# Altium schematic sheet Grabber.schdoc: Grabber
size 420 x 297 mm; Author: G.K.; CompanyName: WUT; DrawnBy: G.K.; Organization: WUT; Address1: Warsaw Univeristy of Technology; Address2: Nowowiejska 15/19; DocumentNumber: 1; SheetNumber: 1; SheetTotal: 2; EDA_Number: ARTIQ; Projet: KASLI 3U subsystem; ModifiedBy: -; CreateDate: XX/XX/XXXX; CheckedDate: -; Title2: Extension board; DivGrp: ISE; Designer: G.K.; ModifiedDate: -; ProjectName: KASLI 3U subsystem
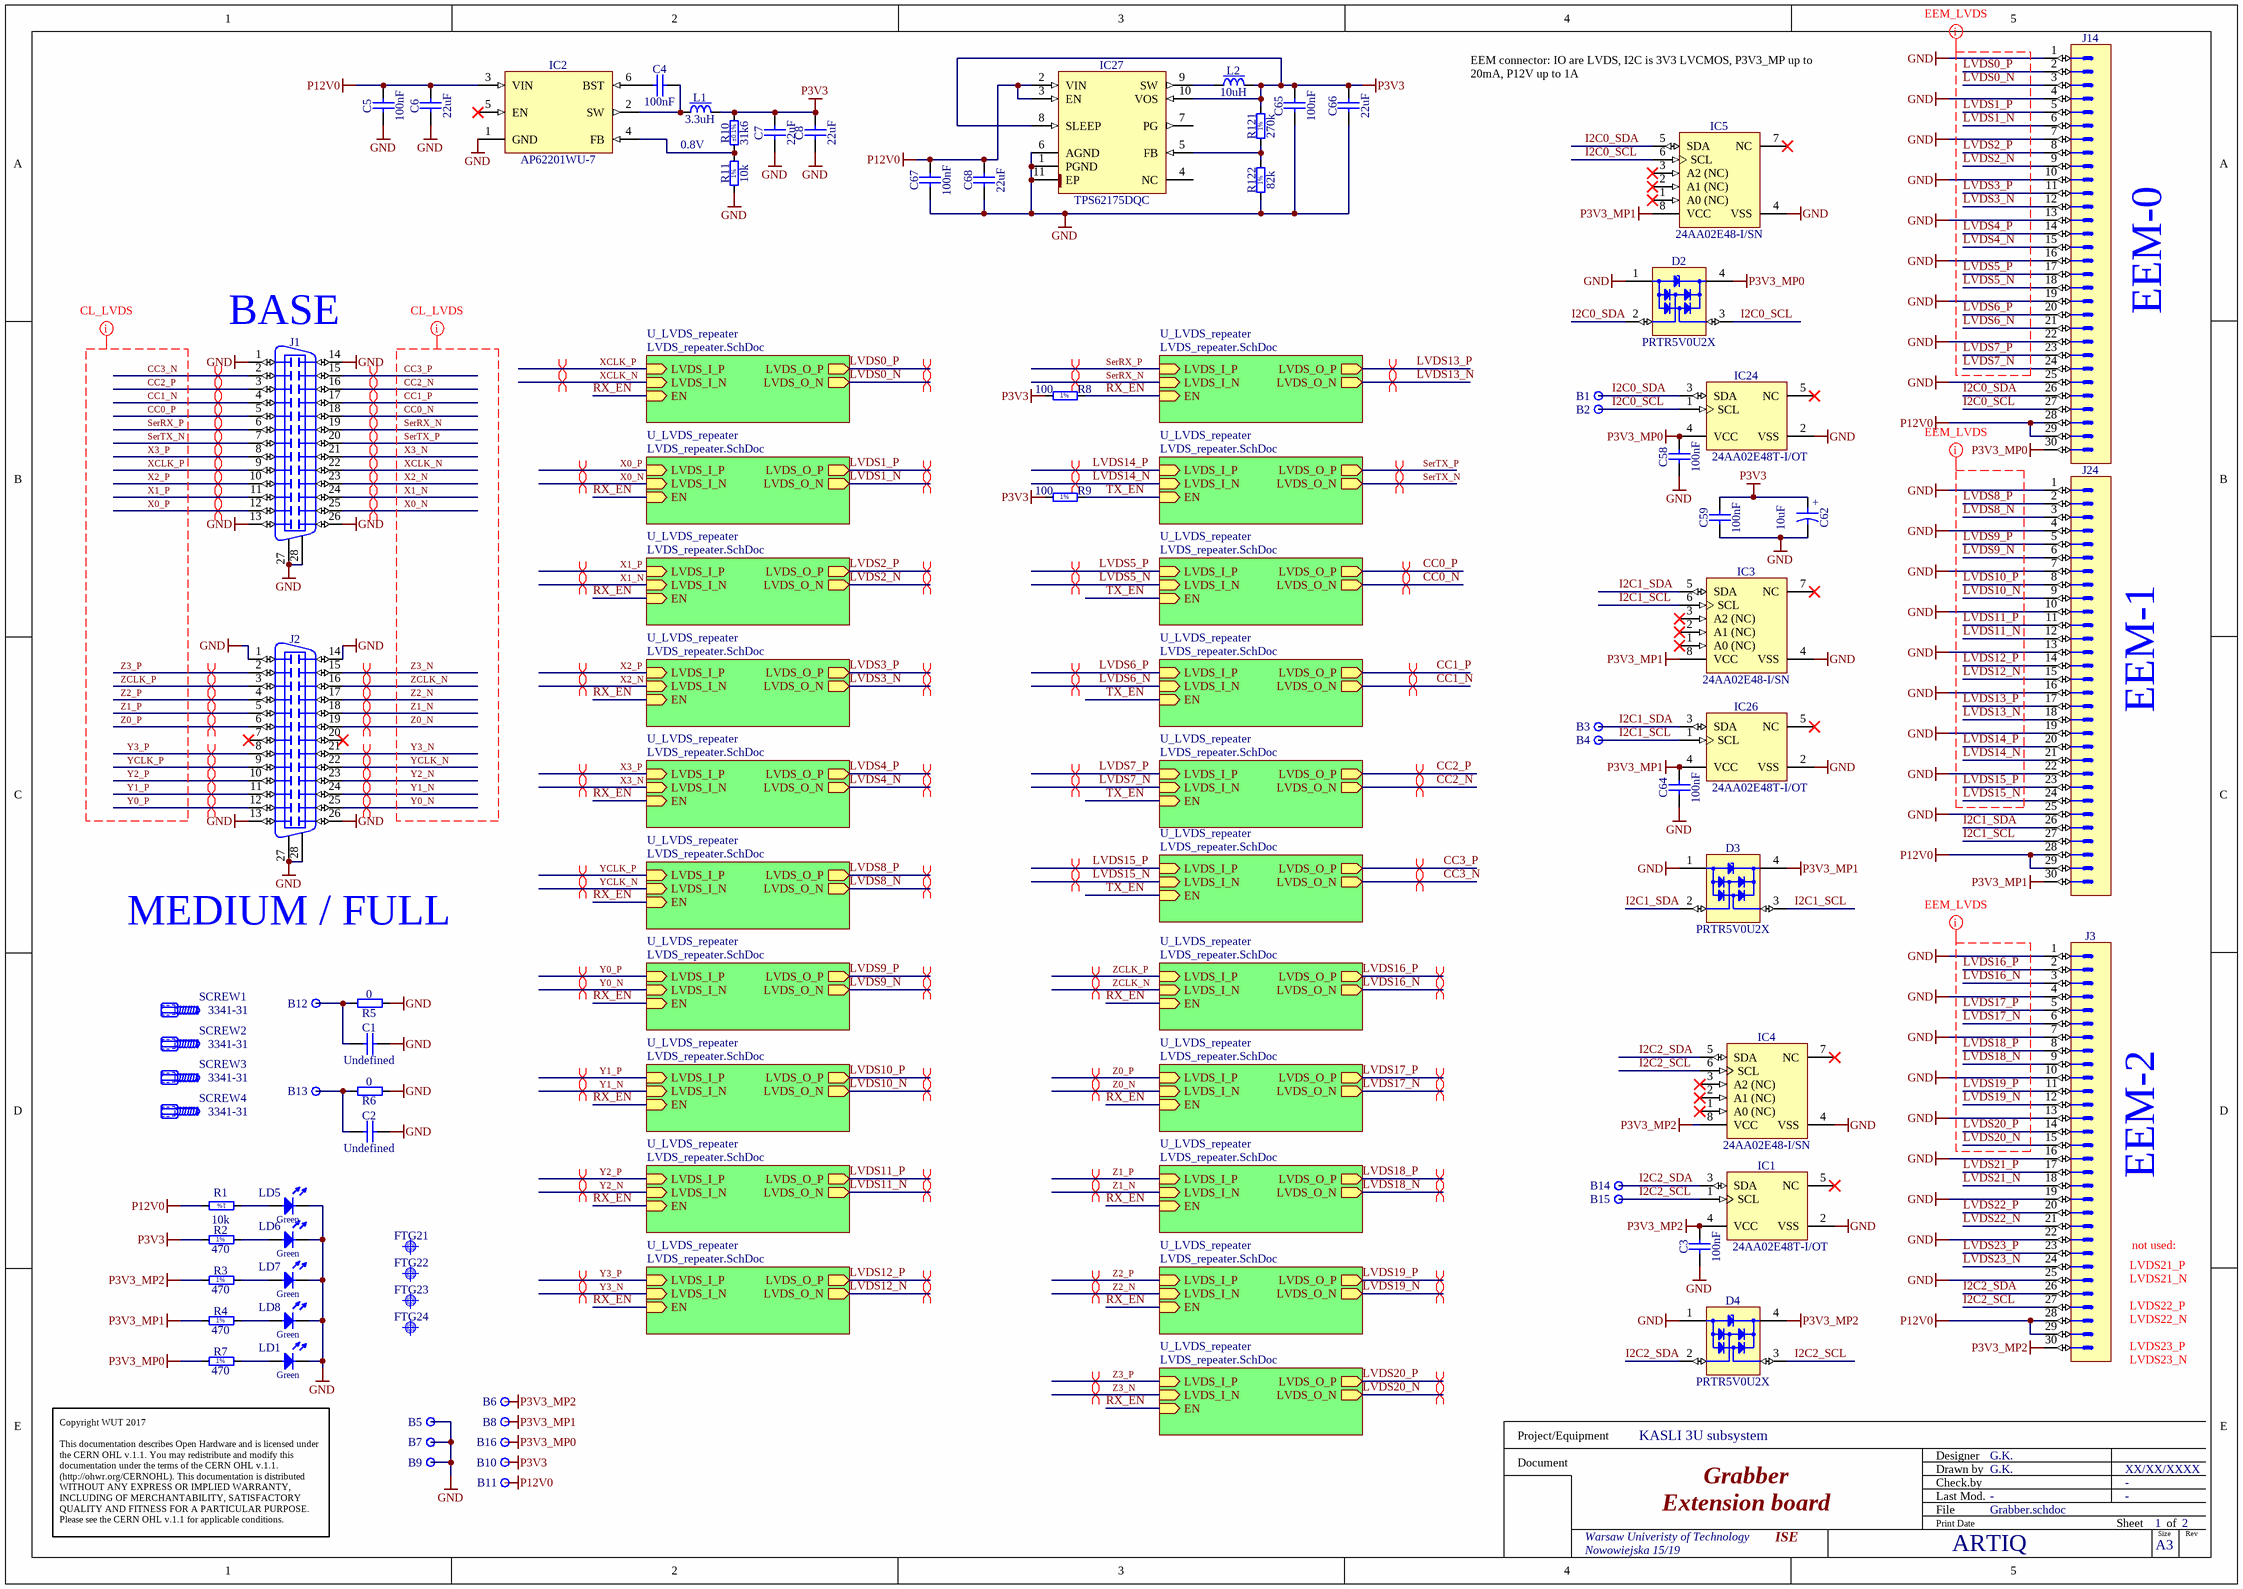
[diagram p0: Grabber.schdoc]

## Parts
B1  Plated Hole  [c130h60]  (value not drawn)
B2  Plated Hole  [c130h60]  (value not drawn)
B3  Plated Hole  [c130h60]  (value not drawn)
B4  Plated Hole  [c130h60]  (value not drawn)
B5  Plated Hole  [c130h60]  (value not drawn)
B6  Plated Hole  [c130h60]  (value not drawn)
B7  Plated Hole  [c130h60]  (value not drawn)
B8  Plated Hole  [c130h60]  (value not drawn)
B9  Plated Hole  [c130h60]  (value not drawn)
B10  Plated Hole  [c130h60]  (value not drawn)
B11  Plated Hole  [c130h60]  (value not drawn)
B12  Plated Hole  [MTG270_500]  (value not drawn)
B13  Plated Hole  [MTG270_500]  (value not drawn)
B14  Plated Hole  [c130h60]  (value not drawn)
B15  Plated Hole  [c130h60]  (value not drawn)
B16  Plated Hole  [c130h60]  (value not drawn)
C1  Undefined  [CAPC2012X135N]
C2  Undefined  [CAPC2012X135N]
C3  100nF  [CAPC1005X55N]
C4  100nF  [CAPC1005X55N]
C5  100nF  [CAPC1005X55N]
C6  22uF  [CAPC2012X135N]
C7  22uF  [CAPC2012X135N]
C8  22uF  [CAPC2012X135N]
C58  100nF  [CAPC1005X55N]
C59  100nF  [CAPC1005X55N]
C62  10uF  [CAPAE430X540N]
C64  100nF  [CAPC1005X55N]
C65  100nF  [CAPC1005X55N]
C66  22uF  [CAPC2012X135N]
C67  100nF  [CAPC1005X55N]
C68  22uF  [CAPC2012X135N]
D2  PRTR5V0U2X  [SOT190P230X110-4N]
D3  PRTR5V0U2X  [SOT190P230X110-4N]
D4  PRTR5V0U2X  [SOT190P230X110-4N]
FTG21  Use only in PCB  [FIDUCIAL_TOP_C100-200]  (value not drawn)
FTG22  Use only in PCB  [FIDUCIAL_TOP_S100-200]  (value not drawn)
FTG23  Use only in PCB  [FIDUCIAL_TOP_S200-400]  (value not drawn)
FTG24  Use only in PCB  [FIDUCIAL_TOP_S100-200]  (value not drawn)
IC1  24AA02E48T-I/OT  [SOT95P280X145-5N]
IC2  AP62201WU-7  [SOT95P280X100-6N]
IC3  24AA02E48-I/SN  [SOIC127P600X175-8N]
IC4  24AA02E48-I/SN  [SOIC127P600X175-8N]
IC5  24AA02E48-I/SN  [SOIC127P600X175-8N]
IC24  24AA02E48T-I/OT  [SOT95P280X145-5N]
IC26  24AA02E48T-I/OT  [SOT95P280X145-5N]
IC27  TPS62175DQC  [SON50P200X300X80-11N-R94X250]
J1  MDR 26  [3M_N10226-5212PC]  (value not drawn)
J2  MDR 26  [3M_N10226-5212PC]  (value not drawn)
J3  (no value)  [3M_N2530-6002RB]
J14  (no value)  [3M_N2530-6002RB]
J24  (no value)  [3M_N2530-6002RB]
L1  3.3uH  [IND_WURTH_WE-TPC_4828]
L2  10uH  [IND_MURATA-PS_8400]
LD1  Green  [LED_KINGBRIGHT_KPH-1608CGCK]  (value not drawn)
LD5  Green  [LED_KINGBRIGHT_KPH-1608CGCK]  (value not drawn)
LD6  Green  [LED_KINGBRIGHT_KPH-1608CGCK]  (value not drawn)
LD7  Green  [LED_KINGBRIGHT_KPH-1608CGCK]  (value not drawn)
LD8  Green  [LED_KINGBRIGHT_KPH-1608CGCK]  (value not drawn)
R1  10k  [RESC1005X40N]
R2  470  [RESC1005X40N]
R3  470  [RESC1005X40N]
R4  470  [RESC1005X40N]
R5  0  [RESC1608X55N]
R6  0  [RESC1608X55N]
R7  470  [RESC1005X40N]
R8  100  [RESC1005X40N]
R9  100  [RESC1005X40N]
R10  31k6  Tolerance: ±0.1%  [RESC1005X35N]
R11  10k  [RESC1005X40N]
R121  270k  [RESC1608X55N]
R122  82k  [RESC1608X55N]
SCREW1  3341-31  [3M_3341-31]
SCREW2  3341-31  [3M_3341-31]
SCREW3  3341-31  [3M_3341-31]
SCREW4  3341-31  [3M_3341-31]

## Sub-sheets
U_LVDS_repeater = LVDS_repeater.SchDoc: LVDS_I_P (in), LVDS_I_N (in), LVDS_O_P (out), LVDS_O_N (out), EN (in)
U_LVDS_repeater = LVDS_repeater.SchDoc: LVDS_I_P (in), LVDS_I_N (in), LVDS_O_P (out), LVDS_O_N (out), EN (in)
U_LVDS_repeater = LVDS_repeater.SchDoc: LVDS_I_P (in), LVDS_I_N (in), LVDS_O_P (out), LVDS_O_N (out), EN (in)
U_LVDS_repeater = LVDS_repeater.SchDoc: LVDS_I_P (in), LVDS_I_N (in), LVDS_O_P (out), LVDS_O_N (out), EN (in)
U_LVDS_repeater = LVDS_repeater.SchDoc: LVDS_I_P (in), LVDS_I_N (in), LVDS_O_P (out), LVDS_O_N (out), EN (in)
U_LVDS_repeater = LVDS_repeater.SchDoc: LVDS_I_P (in), LVDS_I_N (in), LVDS_O_P (out), LVDS_O_N (out), EN (in)
U_LVDS_repeater = LVDS_repeater.SchDoc: LVDS_I_P (in), LVDS_I_N (in), LVDS_O_P (out), LVDS_O_N (out), EN (in)
U_LVDS_repeater = LVDS_repeater.SchDoc: LVDS_I_P (in), LVDS_I_N (in), LVDS_O_P (out), LVDS_O_N (out), EN (in)
U_LVDS_repeater = LVDS_repeater.SchDoc: LVDS_I_P (in), LVDS_I_N (in), LVDS_O_P (out), LVDS_O_N (out), EN (in)
U_LVDS_repeater = LVDS_repeater.SchDoc: LVDS_I_P (in), LVDS_I_N (in), LVDS_O_P (out), LVDS_O_N (out), EN (in)
U_LVDS_repeater = LVDS_repeater.SchDoc: LVDS_I_P (in), LVDS_I_N (in), LVDS_O_P (out), LVDS_O_N (out), EN (in)
U_LVDS_repeater = LVDS_repeater.SchDoc: LVDS_I_P (in), LVDS_I_N (in), LVDS_O_P (out), LVDS_O_N (out), EN (in)
U_LVDS_repeater = LVDS_repeater.SchDoc: LVDS_I_P (in), LVDS_I_N (in), LVDS_O_P (out), LVDS_O_N (out), EN (in)
U_LVDS_repeater = LVDS_repeater.SchDoc: LVDS_I_P (in), LVDS_I_N (in), LVDS_O_P (out), LVDS_O_N (out), EN (in)
U_LVDS_repeater = LVDS_repeater.SchDoc: LVDS_I_P (in), LVDS_I_N (in), LVDS_O_P (out), LVDS_O_N (out), EN (in)
U_LVDS_repeater = LVDS_repeater.SchDoc: LVDS_I_P (in), LVDS_I_N (in), LVDS_O_P (out), LVDS_O_N (out), EN (in)
U_LVDS_repeater = LVDS_repeater.SchDoc: LVDS_I_P (in), LVDS_I_N (in), LVDS_O_P (out), LVDS_O_N (out), EN (in)
U_LVDS_repeater = LVDS_repeater.SchDoc: LVDS_I_P (in), LVDS_I_N (in), LVDS_O_P (out), LVDS_O_N (out), EN (in)
U_LVDS_repeater = LVDS_repeater.SchDoc: LVDS_I_P (in), LVDS_I_N (in), LVDS_O_P (out), LVDS_O_N (out), EN (in)
U_LVDS_repeater = LVDS_repeater.SchDoc: LVDS_I_P (in), LVDS_I_N (in), LVDS_O_P (out), LVDS_O_N (out), EN (in)
U_LVDS_repeater = LVDS_repeater.SchDoc: LVDS_I_P (in), LVDS_I_N (in), LVDS_O_P (out), LVDS_O_N (out), EN (in)

## Nets
GND: B5.1 B7.1 B9.1 C1.2 C2.2 C3.1 C5.1 C6.1 C7.1 C8.1 C58.1 C59.1 C62.2 C64.1 C65.1 C66.1 C67.1 C68.1 D2.1(GND) D3.1(GND) D4.1(GND) IC1.2(VSS) IC2.1(GND) IC3.4(VSS) IC4.4(VSS) IC5.4(VSS) IC24.2(VSS) IC26.2(VSS) IC27.1(PGND) IC27.6(AGND) IC27.11(EP) J1.1 J1.13 J1.14 J1.26 J1.27 J1.28 J2.1 J2.13 J2.14 J2.26 J2.27 J2.28 J3.1 J3.4 J3.7 J3.10 J3.13 J3.16 J3.19 J3.22 J3.25 J14.1 J14.4 J14.7 J14.10 J14.13 J14.16 J14.19 J14.22 J14.25 J24.1 J24.4 J24.7 J24.10 J24.13 J24.16 J24.19 J24.22 J24.25 LD1.1(C) LD5.1(C) LD6.1(C) LD7.1(C) LD8.1(C) R5.1 R6.1 R11.1 R122.1
P3V3: B10.1 C7.2 C8.2 C59.2 C62.1 C65.2 C66.2 IC27.8(SLEEP) IC27.10(VOS) L1.2 L2.2 R2.1 R8.1 R9.1 R10.2 R121.2
P3V3_MP0: B16.1 C58.2 D2.4(VCC) IC24.4(VCC) J14.30 R7.1
P3V3_MP1: B8.1 C64.2 D3.4(VCC) IC3.8(VCC) IC5.8(VCC) IC26.4(VCC) J24.30 R4.1
P3V3_MP2: B6.1 C3.2 D4.4(VCC) IC1.4(VCC) IC4.8(VCC) J3.30 R3.1
P12V0: B11.1 C5.2 C6.2 C67.2 C68.2 IC2.3(VIN) IC27.2(VIN) IC27.3(EN) J3.28 J3.29 J14.28 J14.29 J24.28 J24.29 R1.2
CC0_N: J1.18 ; sheet U_LVDS_repeater/LVDS_O_N
CC0_P: J1.5 ; sheet U_LVDS_repeater/LVDS_O_P
CC1_N: J1.4 ; sheet U_LVDS_repeater/LVDS_O_N
CC1_P: J1.17 ; sheet U_LVDS_repeater/LVDS_O_P
CC2_N: J1.16 ; sheet U_LVDS_repeater/LVDS_O_N
CC2_P: J1.3 ; sheet U_LVDS_repeater/LVDS_O_P
CC3_N: J1.2 ; sheet U_LVDS_repeater/LVDS_O_N
CC3_P: J1.15 ; sheet U_LVDS_repeater/LVDS_O_P
I2C0_SCL: B2.1 D2.3(I/O2) IC5.6(SCL) IC24.1(SCL) J14.27
I2C0_SDA: B1.1 D2.2(I/O1) IC5.5(SDA) IC24.3(SDA) J14.26
I2C1_SCL: B4.1 D3.3(I/O2) IC3.6(SCL) IC26.1(SCL) J24.27
I2C1_SDA: B3.1 D3.2(I/O1) IC3.5(SDA) IC26.3(SDA) J24.26
I2C2_SCL: B15.1 D4.3(I/O2) IC1.1(SCL) IC4.6(SCL) J3.27
I2C2_SDA: B14.1 D4.2(I/O1) IC1.3(SDA) IC4.5(SDA) J3.26
LVDS0_N: J14.3 ; sheet U_LVDS_repeater/LVDS_O_N
LVDS0_P: J14.2 ; sheet U_LVDS_repeater/LVDS_O_P
LVDS1_N: J14.6 ; sheet U_LVDS_repeater/LVDS_O_N
LVDS1_P: J14.5 ; sheet U_LVDS_repeater/LVDS_O_P
LVDS2_N: J14.9 ; sheet U_LVDS_repeater/LVDS_O_N
LVDS2_P: J14.8 ; sheet U_LVDS_repeater/LVDS_O_P
LVDS3_N: J14.12 ; sheet U_LVDS_repeater/LVDS_O_N
LVDS3_P: J14.11 ; sheet U_LVDS_repeater/LVDS_O_P
LVDS4_N: J14.15 ; sheet U_LVDS_repeater/LVDS_O_N
LVDS4_P: J14.14 ; sheet U_LVDS_repeater/LVDS_O_P
LVDS5_N: J14.18 ; sheet U_LVDS_repeater/LVDS_I_N
LVDS5_P: J14.17 ; sheet U_LVDS_repeater/LVDS_I_P
LVDS6_N: J14.21 ; sheet U_LVDS_repeater/LVDS_I_N
LVDS6_P: J14.20 ; sheet U_LVDS_repeater/LVDS_I_P
LVDS7_N: J14.24 ; sheet U_LVDS_repeater/LVDS_I_N
LVDS7_P: J14.23 ; sheet U_LVDS_repeater/LVDS_I_P
LVDS8_N: J24.3 ; sheet U_LVDS_repeater/LVDS_O_N
LVDS8_P: J24.2 ; sheet U_LVDS_repeater/LVDS_O_P
LVDS9_N: J24.6 ; sheet U_LVDS_repeater/LVDS_O_N
LVDS9_P: J24.5 ; sheet U_LVDS_repeater/LVDS_O_P
LVDS10_N: J24.9 ; sheet U_LVDS_repeater/LVDS_O_N
LVDS10_P: J24.8 ; sheet U_LVDS_repeater/LVDS_O_P
LVDS11_N: J24.12 ; sheet U_LVDS_repeater/LVDS_O_N
LVDS11_P: J24.11 ; sheet U_LVDS_repeater/LVDS_O_P
LVDS12_N: J24.15 ; sheet U_LVDS_repeater/LVDS_O_N
LVDS12_P: J24.14 ; sheet U_LVDS_repeater/LVDS_O_P
LVDS13_N: J24.18 ; sheet U_LVDS_repeater/LVDS_O_N
LVDS13_P: J24.17 ; sheet U_LVDS_repeater/LVDS_O_P
LVDS14_N: J24.21 ; sheet U_LVDS_repeater/LVDS_I_N
LVDS14_P: J24.20 ; sheet U_LVDS_repeater/LVDS_I_P
LVDS15_N: J24.24 ; sheet U_LVDS_repeater/LVDS_I_N
LVDS15_P: J24.23 ; sheet U_LVDS_repeater/LVDS_I_P
LVDS16_N: J3.3 ; sheet U_LVDS_repeater/LVDS_O_N
LVDS16_P: J3.2 ; sheet U_LVDS_repeater/LVDS_O_P
LVDS17_N: J3.6 ; sheet U_LVDS_repeater/LVDS_O_N
LVDS17_P: J3.5 ; sheet U_LVDS_repeater/LVDS_O_P
LVDS18_N: J3.9 ; sheet U_LVDS_repeater/LVDS_O_N
LVDS18_P: J3.8 ; sheet U_LVDS_repeater/LVDS_O_P
LVDS19_N: J3.12 ; sheet U_LVDS_repeater/LVDS_O_N
LVDS19_P: J3.11 ; sheet U_LVDS_repeater/LVDS_O_P
LVDS20_N: J3.15 ; sheet U_LVDS_repeater/LVDS_O_N
LVDS20_P: J3.14 ; sheet U_LVDS_repeater/LVDS_O_P
LVDS21_N: J3.18
LVDS21_P: J3.17
LVDS22_N: J3.21
LVDS22_P: J3.20
LVDS23_N: J3.24
LVDS23_P: J3.23
RX_EN: R8.2 ; sheet U_LVDS_repeater/EN, sheet U_LVDS_repeater/EN, sheet U_LVDS_repeater/EN, sheet U_LVDS_repeater/EN, sheet U_LVDS_repeater/EN, sheet U_LVDS_repeater/EN, sheet U_LVDS_repeater/EN, sheet U_LVDS_repeater/EN, sheet U_LVDS_repeater/EN, sheet U_LVDS_repeater/EN, sheet U_LVDS_repeater/EN, sheet U_LVDS_repeater/EN, sheet U_LVDS_repeater/EN, sheet U_LVDS_repeater/EN, sheet U_LVDS_repeater/EN, sheet U_LVDS_repeater/EN
SerRX_N: J1.19 ; sheet U_LVDS_repeater/LVDS_I_N
SerRX_P: J1.6 ; sheet U_LVDS_repeater/LVDS_I_P
SerTX_N: J1.7 ; sheet U_LVDS_repeater/LVDS_O_N
SerTX_P: J1.20 ; sheet U_LVDS_repeater/LVDS_O_P
TX_EN: R9.2 ; sheet U_LVDS_repeater/EN, sheet U_LVDS_repeater/EN, sheet U_LVDS_repeater/EN, sheet U_LVDS_repeater/EN, sheet U_LVDS_repeater/EN
X0_N: J1.25 ; sheet U_LVDS_repeater/LVDS_I_N
X0_P: J1.12 ; sheet U_LVDS_repeater/LVDS_I_P
X1_N: J1.24 ; sheet U_LVDS_repeater/LVDS_I_N
X1_P: J1.11 ; sheet U_LVDS_repeater/LVDS_I_P
X2_N: J1.23 ; sheet U_LVDS_repeater/LVDS_I_N
X2_P: J1.10 ; sheet U_LVDS_repeater/LVDS_I_P
X3_N: J1.21 ; sheet U_LVDS_repeater/LVDS_I_N
X3_P: J1.8 ; sheet U_LVDS_repeater/LVDS_I_P
XCLK_N: J1.22 ; sheet U_LVDS_repeater/LVDS_I_N
XCLK_P: J1.9 ; sheet U_LVDS_repeater/LVDS_I_P
Y0_N: J2.25 ; sheet U_LVDS_repeater/LVDS_I_N
Y0_P: J2.12 ; sheet U_LVDS_repeater/LVDS_I_P
Y1_N: J2.24 ; sheet U_LVDS_repeater/LVDS_I_N
Y1_P: J2.11 ; sheet U_LVDS_repeater/LVDS_I_P
Y2_N: J2.23 ; sheet U_LVDS_repeater/LVDS_I_N
Y2_P: J2.10 ; sheet U_LVDS_repeater/LVDS_I_P
Y3_N: J2.21 ; sheet U_LVDS_repeater/LVDS_I_N
Y3_P: J2.8 ; sheet U_LVDS_repeater/LVDS_I_P
YCLK_N: J2.22 ; sheet U_LVDS_repeater/LVDS_I_N
YCLK_P: J2.9 ; sheet U_LVDS_repeater/LVDS_I_P
Z0_N: J2.19 ; sheet U_LVDS_repeater/LVDS_I_N
Z0_P: J2.6 ; sheet U_LVDS_repeater/LVDS_I_P
Z1_N: J2.18 ; sheet U_LVDS_repeater/LVDS_I_N
Z1_P: J2.5 ; sheet U_LVDS_repeater/LVDS_I_P
Z2_N: J2.17 ; sheet U_LVDS_repeater/LVDS_I_N
Z2_P: J2.4 ; sheet U_LVDS_repeater/LVDS_I_P
Z3_N: J2.15 ; sheet U_LVDS_repeater/LVDS_I_N
Z3_P: J2.2 ; sheet U_LVDS_repeater/LVDS_I_P
ZCLK_N: J2.16 ; sheet U_LVDS_repeater/LVDS_I_N
ZCLK_P: J2.3 ; sheet U_LVDS_repeater/LVDS_I_P
NetB12_1: B12.1 C1.1 R5.2
NetB13_1: B13.1 C2.1 R6.2
NetC4_1: C4.1 IC2.6(BST)
NetC4_2: C4.2 IC2.2(SW) L1.1
NetIC2_4: IC2.4(FB) R10.1 R11.2
NetIC27_5: IC27.5(FB) R121.1 R122.2
NetIC27_9: IC27.9(SW) L2.1
NetLD1_2: LD1.2(A) R7.2
NetLD5_2: LD5.2(A) R1.1
NetLD6_2: LD6.2(A) R2.2
NetLD7_2: LD7.2(A) R3.2
NetLD8_2: LD8.2(A) R4.2

Not connected (* = marked no-connect by the designer): IC1 5(NC)*; IC2 5(EN)*; IC3 1(A0_(NC))* 2(A1_(NC))* 3(A2_(NC))* 7(NC)*; IC4 1(A0_(NC))* 2(A1_(NC))* 3(A2_(NC))* 7(NC)*; IC5 1(A0_(NC))* 2(A1_(NC))* 3(A2_(NC))* 7(NC)*; IC24 5(NC)*; IC26 5(NC)*; IC27 4(NC) 7(PG); J2 7* 20*

## Layout directives
differential pair: CC0_N, CC0_P, CC1_N, CC1_P, CC2_N, CC2_P, CC3_N, CC3_P, LVDS0_N, LVDS0_P, LVDS1_N, LVDS1_P, LVDS2_N, LVDS2_P, LVDS3_N, LVDS3_P, LVDS4_N, LVDS4_P, LVDS5_N, LVDS5_P, LVDS6_N, LVDS6_P, LVDS7_N, LVDS7_P, LVDS8_N, LVDS8_P, LVDS9_N, LVDS9_P, LVDS10_N, LVDS10_P, LVDS11_N, LVDS11_P, LVDS12_N, LVDS12_P, LVDS13_N, LVDS13_P, LVDS14_N, LVDS14_P, LVDS15_N, LVDS15_P, LVDS16_N, LVDS16_P, LVDS17_N, LVDS17_P, LVDS18_N, LVDS18_P, LVDS19_N, LVDS19_P, LVDS20_N, LVDS20_P, SerRX_N, SerRX_P, SerTX_N, SerTX_P, X0_N, X0_P, X1_N, X1_P, X2_N, X2_P, X3_N, X3_P, XCLK_N, XCLK_P, Y0_N, Y0_P, Y1_N, Y1_P, Y2_N, Y2_P, Y3_N, Y3_P, YCLK_N, YCLK_P, Z0_N, Z0_P, Z1_N, Z1_P, Z2_N, Z2_P, Z3_N, Z3_P, ZCLK_N, ZCLK_P
net class CL_LVDS: CC0_N, CC0_P, CC1_N, CC1_P, CC2_N, CC2_P, CC3_N, CC3_P, SerRX_N, SerRX_P, SerTX_N, SerTX_P, X0_N, X0_P, X1_N, X1_P, X2_N, X2_P, X3_N, X3_P, XCLK_N, XCLK_P, Y0_N, Y0_P, Y1_N, Y1_P, Y2_N, Y2_P, Y3_N, Y3_P, YCLK_N, YCLK_P, Z0_N, Z0_P, Z1_N, Z1_P, Z2_N, Z2_P, Z3_N, Z3_P, ZCLK_N, ZCLK_P
net class EEM_LVDS: LVDS0_N, LVDS0_P, LVDS1_N, LVDS1_P, LVDS2_N, LVDS2_P, LVDS3_N, LVDS3_P, LVDS4_N, LVDS4_P, LVDS5_N, LVDS5_P, LVDS6_N, LVDS6_P, LVDS7_N, LVDS7_P, LVDS8_N, LVDS8_P, LVDS9_N, LVDS9_P, LVDS10_N, LVDS10_P, LVDS11_N, LVDS11_P, LVDS12_N, LVDS12_P, LVDS13_N, LVDS13_P, LVDS14_N, LVDS14_P, LVDS15_N, LVDS15_P, LVDS16_N, LVDS16_P, LVDS17_N, LVDS17_P, LVDS18_N, LVDS18_P, LVDS19_N, LVDS19_P, LVDS20_N, LVDS20_P

## Notes on the sheet
- EEM connector: IO are LVDS, I2C is 3V3 LVCMOS, P3V3_MP up to 20mA, P12V up to 1A
- 0.8V
- (near J14) EEM-0
- (near J1) BASE
- (near J24) EEM-1
- MEDIUM / FULL
- (near J3) EEM-2
- LVDS21_P
- not used:
- LVDS21_N
- LVDS22_P
- LVDS22_N
- LVDS23_P
- LVDS23_N
- Copyright WUT 2017
  This documentation describes Open Hardware and is licensed under the CERN OHL v.1.1. You may redistribute and modify this documentation under the terms of the CERN OHL v.1.1. (http://ohwr.org/CERNOHL). This documentation is distributed WITHOUT ANY EXPRESS OR IMPLIED WARRANTY, INCLUDING OF MERCHANTABILITY, SATISFACTORY QUALITY AND FITNESS FOR A PARTICULAR PURPOSE. Please see the CERN OHL v.1.1 for applicable conditions.
- Project/Equipment
- Document
- Designer
- Drawn by
- Check.by
- File
- Last Mod.
- Print Date
- Sheet
- Size
- A3
- of
- Rev
- (in symbol CAE430-540_10UF_16V_20%) +
- (in symbol R0402_10K_1%_0.0625W_100PPM) 1%
- (in symbol R0402_100R_1%_0.1W_100PPM) 1%
- (in symbol R0402_470R_1%_0.0625W_100PPM) 1%
- (in symbol R0603_82K_1%_0.1W_100PPM) 1%
- (in symbol R0603_270K_1%_0.1W_100PPM) 1%

## Library data of the parts
B1-B11 B14-B16 = PLATED_HOLE0.6_PAD1.3: Single Terminal Socket; Part Description: Plated Through Hole: Hole Dia.=0.6mm Pad Dia.=1.3mm; Mounted: No; Part Number: PLATED_HOLE0.6_PAD1.3; Component Kind: Standard (No BOM); Component Type: Standard (No BOM); Pin Count: 1; Family: Plated Hole; Socket: No; SMD: No; Sense: No; Status: None; ComponentHeight: 0mm; HelpURL: Undefined; Author: CERN DEM MR; CreateDate: 02.03.2016; LatestRevisionDate: 02.03.2016; PackageDescription: Plated Through Hole: Hole Dia.=0.6mm Pad Dia.=1.3mm
B12 B13 = PLATED_HOLE2.7_PAD5.0: Single Terminal Socket; Part Description: Plated Through Hole: Hole Dia.=2.7mm Pad Dia.=5.0mm; Mounted: No; Part Number: PLATED_HOLE2.7_PAD5.0; Component Kind: Standard (No BOM); Component Type: Standard (No BOM); Pin Count: 1; Family: Plated Hole; Socket: No; SMD: No; Sense: No; Status: None; ComponentHeight: 0mm; HelpURL: Undefined; Author: CERN DEM JMW; CreateDate: 27.09.2011; LatestRevisionDate: 27.09.2011; PackageDescription: Plated Through Hole: Hole Dia.=2.7mm Pad Dia.=5.0mm
C1 C2 = CC0805_NO-VALUE: Non-polarised capacitor; Part Description: Reserved Footprint For 0805(2012) Chip Ceramic Capacitor; Mounted: No; Part Number: CC0805_NO-VALUE; Component Kind: Standard; Component Type: Standard; Pin Count: 2; Value: Undefined; Status: None; Manufacturer: Undefined; Manufacturer Part Number: CC0805_NO-VALUE; Case: 0805; Socket: No; SMD: Yes; Sense: No; Manufacturer1 ComponentHeight: 1.35mm; HelpURL: Undefined; Author: CERN DEM JLC; CreateDate: 10.12.2008; LatestRevisionDate: 11.09.2013
C3-C5 C58 C59 C64 C65 C67 = CC0402_100NF_16V_10%_X5R: Non-polarised capacitor; Part Description: SMD Multilayer Chip Ceramic Capacitor; Manufacturer: GENERIC; Manufacturer1 Part Number: GRM155R61C104KA88D; Voltage: 16V; TC: X5R; Tolerance: ±10%; Part Number: CC0402_100NF_16V_10%_X5R; Component Kind: Standard; Component Type: Standard; Pin Count: 2; Value: 100nF; Status: None; Manufacturer Part Number: CC0402_100NF_16V_10%_X5R; Case: 0402; Mounted: Yes; Socket: No; SMD: Yes; Sense: No; Manufacturer1 Example: MURATA; Manufacturer1 ComponentHeight: 0.55mm; HelpURL: \\cern.ch\dfs\Applications\Altium\Datasheets\CC0402_X5R_MURATA_GRM.pdf; Author: CERN DEM JLC; CreateDate: 10.12.2013; LatestRevisionDate: 10.12.2013
C6-C8 C66 C68 = CC0805_22UF_16V_10%_X5R: Non-polarised capacitor; Part Description: SMD Multilayer Chip Ceramic Capacitor; Manufacturer: GENERIC; Manufacturer1 Part Number: C2012X5R1C226KT; Voltage: 16V; TC: X5R; Tolerance: ±10%; Part Number: CC0805_22UF_16V_10%_X5R; Component Kind: Standard; Component Type: Standard; Pin Count: 2; Value: 22uF; Status: Preferred; Manufacturer Part Number: CC0805_22UF_16V_10%_X5R; Case: 0805; Mounted: Yes; Socket: No; SMD: Yes; Sense: No; Manufacturer1 Example: TDK; Manufacturer1 ComponentHeight: 1.35mm; HelpURL: \\cern.ch\dfs\Applications\Altium\Datasheets\CC0805_X5R_TDK_C.pdf; Author: CERN DEM JLC; CreateDate: 25.10.2012; LatestRevisionDate: 25.10.2012
C62 = CAE430-540_10UF_16V_20%: Polarised capacitor; Part Description: Aluminum Electrolytic SMT Capacitor; Manufacturer: PANASONIC; Manufacturer Part Number: EEEFK1C100AR; Voltage: 16V; Tolerance: ±20%; Part Number: CAE430-540_10UF_16V_20%; Component Kind: Standard; Component Type: Standard; Pin Count: 2; Value: 10uF; Status: Not Recommended; Case: B; Mounted: Yes; Socket: No; SMD: Yes; Sense: No; ComponentHeight: 5.8mm; HelpURL: \\cern.ch\dfs\Applications\Altium\Datasheets\CAE_PANASONIC_FK.pdf; Author: CERN DEM JLC; CreateDate: 03.12.2007; LatestRevisionDate: 05.11.2014
D2-D4 = PRTR5V0U2X: Ultra Low Capacitance Double Rail-to-Rail ESD Protection Diode; Part Description: Ultra Low Capacitance (1pF) Double Rail-to-Rail ESD Protection Diode (8kV); Manufacturer: NXP SEMICONDUCTORS; Voltage: 5.5V; PressFit: No; Bonding: No; Part Number: PRTR5V0U2X; Component Kind: Standard; Component Type: Standard; Device: PRTR5V0U2X; PackageDescription: SOT143B, SOT, 1.90mm Pitch; 4 Pin, 1.30mm W X 2.90mm L X 1.10mm H body, IPC Medium Density; Manufacturer Part Number: PRTR5V0U2X; Pin Count: 4; Case: SOT143B; Mounted: Yes; Socket: No; SMD: Yes; Sense: No; ComponentHeight: 1.1mm; HelpURL: \\cern.ch\dfs\Applications\Altium\Datasheets\PRTR5V0U2X.pdf; Author: CERN DEM JLC; CreateDate: 22.03.2011; LatestRevisionDate: 22.03.2011
FTG21 = FIDUCIAL_TARGET_C100-200: Fiducial Target; Part Description: Round Fiducial Target, Top Layer, 1.0mm, Top Solder 2.0mm, Keepout =2.0mm; Mounted: No; Part Number: FIDUCIAL_TARGET_C100-200; Component Kind: Standard (No BOM); Component Type: Standard (No BOM); Pin Count: 1; Family: Fiducial; Socket: No; SMD: Yes; Sense: No; Status: None; ComponentHeight: 0mm; HelpURL: Undefined; Author: CERN DEM JLC; CreateDate: 09.02.2010; LatestRevisionDate: 04.04.2012; PackageDescription: Round Fiducial Target, Top Layer, 1.0mm, Top Solder 2.0mm, Keepout =2.0mm
FTG22 FTG24 = FIDUCIAL_TARGET_S100-200: Fiducial Target; Part Description: Square Fiducial Target, Top Layer, 1.0mm, Top Solder 2.0mm, Keepout =2.0mm; Mounted: No; Part Number: FIDUCIAL_TARGET_S100-200; Component Kind: Standard (No BOM); Component Type: Standard (No BOM); Pin Count: 1; Family: Fiducial; Socket: No; SMD: Yes; Sense: No; Status: None; ComponentHeight: 0mm; HelpURL: Undefined; Author: CERN DEM JLC; CreateDate: 09.02.2010; LatestRevisionDate: 04.04.2012; PackageDescription: Square Fiducial Target, Top Layer, 1.0mm, Top Solder 2.0mm, Keepout =2.0mm
FTG23 = FIDUCIAL_TARGET_S200-400: Fiducial Target; Part Description: Square Fiducial Target, Top Layer, 2.0mm, Top Solder 4.0mm, Keepout =4.0mm; Mounted: No; Part Number: FIDUCIAL_TARGET_S200-400; Component Kind: Standard (No BOM); Component Type: Standard (No BOM); Pin Count: 1; Family: Fiducial; Socket: No; SMD: Yes; Sense: No; Status: None; ComponentHeight: 0mm; HelpURL: Undefined; Author: CERN DEM JLC; CreateDate: 02.06.2008; LatestRevisionDate: 04.04.2012; PackageDescription: Square Fiducial Target, Top Layer, 2.0mm, Top Solder 4.0mm, Keepout =4.0mm
IC1 IC24 IC26 = 24AA02E48T-I/OT: 1.7V-5.5V, 2K I2C Serial EEPROM With EUI-48 Node Identity; Manufacturer: MICROCHIP TECHNOLOGY; PressFit: No; Bonding: No; Part Number: 24AA02E48T-I/OT; Component Kind: Standard; Component Type: Standard; Device: 24AA02E48T-I/OT; PackageDescription: SOT, 0.95mm pitch; 5 pin, 1.60mm W X 2.90mm L X 1.45mm H body, IPC Medium Density; Part Description: 1.7V-5.5V, 2K I2C Serial EEPROM With EUI-48 Node Identity; Manufacturer Part Number: 24AA02E48T-I/OT; Pin Count: 5; Case: SOT23-5; Mounted: Yes; Socket: No; SMD: Yes; Sense: No; ComponentHeight: 1.45mm; HelpURL: \\cern.ch\dfs\Applications\Altium\Datasheets\24AA02E48T-I-OT.pdf; Author: CERN DEM MR; CreateDate: 31.03.2016; LatestRevisionDate: 31.03.2016
IC2 = AP62201WU-7: 4.2V TO 18V INPUT, 2A LOW IQ SYNCHRONOUS BUCK CONVERTER; Manufacturer: DIODES INCORPORATED; PressFit: No; Bonding: No; Part Number: AP62201WU-7; Component Kind: Standard; Component Type: Standard; Device: AP62201WU-7; PackageDescription: SOT23, 0.95mm Pitch; 6 Pin, 1.625mm W X 2.90mm L X 1.00mm H body, IPC Medium Density; Part Description: 4.2V TO 18V INPUT, 2A LOW IQ SYNCHRONOUS BUCK CONVERTER; Manufacturer Part Number: AP62201WU-7; Pin Count: 6; Case: SOT23-6; Mounted: Yes; Socket: No; SMD: Yes; Sense: No; ComponentHeight: 1.1mm; HelpURL: \\cern.ch\dfs\Applications\Altium\Datasheets\AP6220x.pdf; Author: CERN DEM HF; CreateDate: 07.01.2022; LatestRevisionDate: 07.01.2022
IC3-IC5 = MEM_24AA02E48-I/SN: 1.7V-5.5V, 2K I2C™ Serial EEPROMs with EUI-48™ Node Identity; Manufacturer: MICROCHIP TECHNOLOGY; PressFit: No; Bonding: No; Part Number: 24AA02E48-I/SN; Component Kind: Standard; Component Type: Standard; Device: 24AA02E48-I/SN; PackageDescription: SOIC, 1.27mm Pitch; 8 Pin - Body 4x5mm, IPC Medium Density; Part Description: 1.7V-5.5V, 2K I2C™ Serial EEPROMs with EUI-48™ Node Identity; Manufacturer Part Number: 24AA02E48-I/SN; Pin Count: 8; Case: SOIC8; Mounted: Yes; Socket: No; SMD: Yes; Sense: No; ComponentHeight: 1.75mm; HelpURL: \\cern.ch\dfs\Applications\Altium\Datasheets\24AA025E48-I-SN.pdf; Author: CERN DEM MR; CreateDate: 19.07.2016; LatestRevisionDate: 19.07.2016
IC27 = TPS62175DQC: 4.75-28VDC to 1-6VDC, 500mA Step-Down Converter With Sleep Mode; Manufacturer: TEXAS INSTRUMENTS; PressFit: No; Bonding: No; Part Number: TPS62175DQC; Component Kind: Standard; Component Type: Standard; Device: TPS62175DQC; PackageDescription: SON, 10-Leads, Body 2x3mm, Pitch 0.5mm, Thermal Pad 0.94x2.5mm, IPC Medium Density; Part Description: 4.75-28VDC to 1-6VDC, 500mA Step-Down Converter With Sleep Mode; Manufacturer Part Number: TPS62175DQC; Pin Count: 11; Case: SON10; Mounted: Yes; Socket: No; SMD: Yes; Sense: No; ComponentHeight: 0.8mm; HelpURL: \\cern.ch\dfs\Applications\Altium\Datasheets\TPS62175DQC.pdf; Author: CERN DEM JMW; CreateDate: 11.08.2015; LatestRevisionDate: 11.08.2015
J1 J2 = 3M_N10226-5212PC: Connector Mini D Ribbon (MDR) 26 Female; Part Description: 26 contacts, Mini D Ribbon (MDR), .050" Boardmount Through-hole Right Angle Receptacle-Shielded, Diecast Body, 102 Series; Manufacturer: 3M; PressFit: No; Part Number: 3M_N10226-5212PC; Component Kind: Standard; Component Type: Standard; Pin Count: 28; Family: MDR 26; Mounted: Yes; Socket: No; SMD: No; Sense: No; Status: None; Manufacturer Part Number: N10226-5212PC; ComponentHeight: 9.4mm; HelpURL: \\cern.ch\dfs\Applications\Altium\Datasheets\3M_N10226-5212PC.pdf; Author: CERN DEM JLC; CreateDate: 18.11.2008; LatestRevisionDate: 14.10.2009
J3 J14 J24 = 3M_N2530-6002RB: Connector 30 Male; Part Description: 30 Contacts - Straight .100'' x .100'' Low Profile Four-Wall Header, 2500 Series; Manufacturer: 3M; PressFit: No; Part Number: 3M_N2530-6002RB; Component Kind: Standard; Component Type: Standard; Pin Count: 30; Family: Header 30; Mounted: Yes; Socket: No; SMD: No; Sense: No; Status: None; Manufacturer Part Number: N2530-6002RB; ComponentHeight: 10.03mm; HelpURL: \\cern.ch\dfs\Applications\Altium\Datasheets\3M_N2530-6002RB.pdf; Author: CERN DEM JLC; CreateDate: 11.02.2009; LatestRevisionDate: 11.08.2009
L1 = IND_3.3UH_30%_WURTH_WE-TPC_744043003: Inductor With Core; Part Description: Shielded Tiny Power Inductor (WE-TPC Serie); Manufacturer: WURTH ELEKTRONIK; Power: 2.15A; Resistance: 0.03R; Tolerance: ±30%; Part Number: IND_3.3UH_30%_WURTH_WE-TPC_744043003; Component Kind: Standard; Component Type: Standard; Pin Count: 2; Value: 3.3uH; Manufacturer Part Number: 744043003; Mounted: Yes; Socket: No; SMD: Yes; Sense: No; ComponentHeight: 3mm; HelpURL: \\cern.ch\dfs\Applications\Altium\Datasheets\IND_WURTH_WE-TPC_744043003.pdf; Author: CERN DEM JLC; CreateDate: 12.07.2011; LatestRevisionDate: 24.01.2012
L2 = IND_10UH_10%_MURATA-PS_8400: Inductor With Core; Part Description: Miniature Surface Mount Power Inductor (8400 Serie); Manufacturer: MURATA POWER SOLUTIONS; Manufacturer Part Number: 84103C; Power: 950mA; Resistance: 0.24R; Tolerance: ±10%; Part Number: IND_10UH_10%_MURATA-PS_8400; Component Kind: Standard; Component Type: Standard; Pin Count: 2; Value: 10uH; Status: None; Mounted: Yes; Socket: No; SMD: Yes; Sense: No; ComponentHeight: 2.9mm; HelpURL: \\cern.ch\dfs\Applications\Altium\Datasheets\IND_MURATA-PS_8400.pdf; Author: CERN DEM JLC; CreateDate: 02.07.2012; LatestRevisionDate: 02.07.2012
LD1 LD5-LD8 = LED_KINGBRIGHT_KPH-1608CGCK: LED Green 1C 2A; Part Description: SMD Green LED, Case 1.6mmX0.8mm(0603), 0.65mm Thickness; PressFit: No; Bonding: No; Part Number: LED_KINGBRIGHT_KPH-1608CGCK; Component Kind: Standard; Component Type: Standard; Color: Green; PackageDescription: SMT Green LED, Case 0603, Body L 1.6 x W 0.8mm H 0.65mm; Manufacturer: KINGBRIGHT; Manufacturer Part Number: KPH-1608CGCK; Pin Count: 2; Mounted: Yes; Socket: No; SMD: Yes; Sense: No; ComponentHeight: 0.65mm; HelpURL: \\cern.ch\dfs\Applications\Altium\Datasheets\LED_KINGBRIGHT_KPH-1608CGCK.pdf; Author: CERN DEM JLC; CreateDate: 03.07.2017; LatestRevisionDate: 03.07.2017
R1 R11 = R0402_10K_1%_0.0625W_100PPM: Resistor - 1%; Part Description: General Purpose Thick Film Chip Resistor; Manufacturer: GENERIC; Manufacturer1 Part Number: 232270671003L; TC: ±100ppm/°C; Part Number: R0402_10K_1%_0.0625W_100PPM; Component Kind: Standard; Component Type: Standard; Pin Count: 2; Value: 10k; Status: Not recommended; Power: 0.0625W; Tolerance: ±1%; Manufacturer Part Number: R0402_10K_1%_0.0625W_100PPM; Case: 0402; Mounted: Yes; Sense: No; Socket: No; SMD: Yes; Manufacturer1 Example: YAGEO PHYCOMP; Manufacturer1 ComponentHeight: 0.4mm; HelpURL: \\cern.ch\dfs\Applications\Altium\Datasheets\R0402_Phycomp_RC0402.pdf; Author: CERN DEM JLC; CreateDate: 03.12.2007; LatestRevisionDate: 17.10.2012
R2-R4 R7 = R0402_470R_1%_0.0625W_100PPM: Resistor - 1%; Part Description: General Purpose Thick Film Chip Resistor; Manufacturer: GENERIC; Manufacturer1 Part Number: 232270674701L; TC: ±100ppm/°C; PressFit: No; Part Number: R0402_470R_1%_0.0625W_100PPM; Component Kind: Standard; Component Type: Standard; Pin Count: 2; Value: 470; Status: Not Recommended; Power: 0.0625W; Tolerance: ±1%; Manufacturer Part Number: R0402_470R_1%_0.0625W_100PPM; Case: 0402; Mounted: Yes; Sense: No; Socket: No; SMD: Yes; Manufacturer1 Example: YAGEO PHYCOMP; Manufacturer1 ComponentHeight: 0.4mm; HelpURL: \\cern.ch\dfs\Applications\Altium\Datasheets\R0402_Phycomp_RC0402.pdf; Author: CERN DEM JLC; CreateDate: 03.12.2007; LatestRevisionDate: 17.10.2012
R5 R6 = R0603_0R_JUMPER: Resistor; Part Description: 1A (0.05R Max DC Resistance) Zero Ohm Jumper; Manufacturer: GENERIC; Manufacturer1 Part Number: NRC06Z0; PressFit: No; Part Number: R0603_0R_JUMPER; Component Kind: Standard; Component Type: Standard; Pin Count: 2; Value: 0; Status: Preferred; Manufacturer Part Number: R0603_0R_JUMPER; Case: 0603; Mounted: Yes; Sense: No; Socket: No; SMD: Yes; Manufacturer1 Example: NIC COMPONENT; Manufacturer1 ComponentHeight: 0.55mm; HelpURL: \\cern.ch\dfs\Applications\Altium\Datasheets\R0603_NIC_NRC.pdf; Author: CERN DEM JLC; CreateDate: 03.12.2007; LatestRevisionDate: 13.03.2008
R8 R9 = R0402_100R_1%_0.1W_100PPM: Resistor - 1%; Part Description: General Purpose Thick Film Chip Resistor; Manufacturer: GENERIC; Manufacturer Part Number: R0402_100R_1%_0.1W_100PPM_50V; Manufacturer1 Part Number: ERJ2RKF1000X; Power: 0.1W; TC: ±100ppm/°C; Voltage: 50V; Part Number: R0402_100R_1%_0.1W_100PPM; Component Kind: Standard; Component Type: Standard; Pin Count: 2; Value: 100; Status: Not recommended; Tolerance: ±1%; Case: 0402; Mounted: Yes; Sense: No; Socket: No; SMD: Yes; Manufacturer1 Example: PANASONIC; Manufacturer1 ComponentHeight: 0.4mm; HelpURL: \\cern.ch\dfs\Applications\Altium\Datasheets\R0402_PANASONIC_ERJ2RK.pdf; Author: CERN DEM JLC; CreateDate: 12.12.2013; LatestRevisionDate: 03.03.2015
R10 = R0402_31K6_0.1%_0.063W_25PPM_YAGEO_RT: Resistor - 0.1%; Part Description: Thin Film Chip Resistor; Manufacturer: YAGEO; Manufacturer Part Number: RT0402BRD0731K6L; Power: 0.063W; TC: ±25ppm/°C; Voltage: 50V; PressFit: No; Part Number: R0402_31K6_0.1%_0.063W_25PPM_YAGEO_RT; Component Kind: Standard; Component Type: Standard; Pin Count: 2; Value: 31k6; Status: Not Recommended; Case: 0402; Mounted: Yes; Sense: No; Socket: No; SMD: Yes; ComponentHeight: 0.35mm; HelpURL: \\cern.ch\dfs\Applications\Altium\Datasheets\R0402_YAGEO_RT.pdf; Author: CERN DEM BC; CreateDate: 30.07.2020; LatestRevisionDate: 30.07.2020
R121 = R0603_270K_1%_0.1W_100PPM: Resistor - 1%; Part Description: General Purpose Thick Film Chip Resistor; Manufacturer: GENERIC; Manufacturer1 Part Number: NRC06F2703TRF; Power: 0.1W; TC: ±100ppm/°C; Part Number: R0603_270K_1%_0.1W_100PPM; Component Kind: Standard; Component Type: Standard; Pin Count: 2; Value: 270k; Status: Preferred; Tolerance: ±1%; Manufacturer Part Number: R0603_270K_1%_0.1W_100PPM; Case: 0603; Mounted: Yes; Sense: No; Socket: No; SMD: Yes; Manufacturer1 Example: NIC COMPONENT; Manufacturer1 ComponentHeight: 0.55mm; HelpURL: \\cern.ch\dfs\Applications\Altium\Datasheets\R0603_NIC_NRC.pdf; Author: CERN DEM JLC; CreateDate: 03.12.2007; LatestRevisionDate: 13.03.2008
R122 = R0603_82K_1%_0.1W_100PPM: Resistor - 1%; Part Description: General Purpose Thick Film Chip Resistor; Manufacturer: GENERIC; Manufacturer1 Part Number: NRC06F8202TRF; Power: 0.1W; TC: ±100ppm/°C; Part Number: R0603_82K_1%_0.1W_100PPM; Component Kind: Standard; Component Type: Standard; Pin Count: 2; Value: 82k; Status: Preferred; Tolerance: ±1%; Manufacturer Part Number: R0603_82K_1%_0.1W_100PPM; Case: 0603; Mounted: Yes; Sense: No; Socket: No; SMD: Yes; Manufacturer1 Example: NIC COMPONENT; Manufacturer1 ComponentHeight: 0.55mm; HelpURL: \\cern.ch\dfs\Applications\Altium\Datasheets\R0603_NIC_NRC.pdf; Author: CERN DEM JLC; CreateDate: 03.12.2007; LatestRevisionDate: 13.03.2008
SCREW1-SCREW4 = MECH_MDR_screw_lock: VHDCI Female Screw Lock; Part Description: MDR Female Screw Locks, Thread Size: M2.5; Manufacturer: 3M; PressFit: No; Part Number: 3M_3341-31; Component Kind: Standard; Component Type: Mechanical; Pin Count: 0; PackageDescription: MDR Female Screw Locks, Thread Size: M2.5; Mounted: Yes; Socket: No; SMD: No; Sense: No; Status: None; Value: 3341-31; Manufacturer Part Number: 3341-31; ComponentHeight: 5.48mm; HelpURL: \\cern.ch\dfs\Applications\Altium\Datasheets\TYCO_749087-2.pdf; Author: GK; CreateDate: 10.09.2013; LatestRevisionDate: 10.09.2013